# EAGLE schematic M868Hvrs2 (EAGLE 6.6.0)

## Sheet 1 of 3
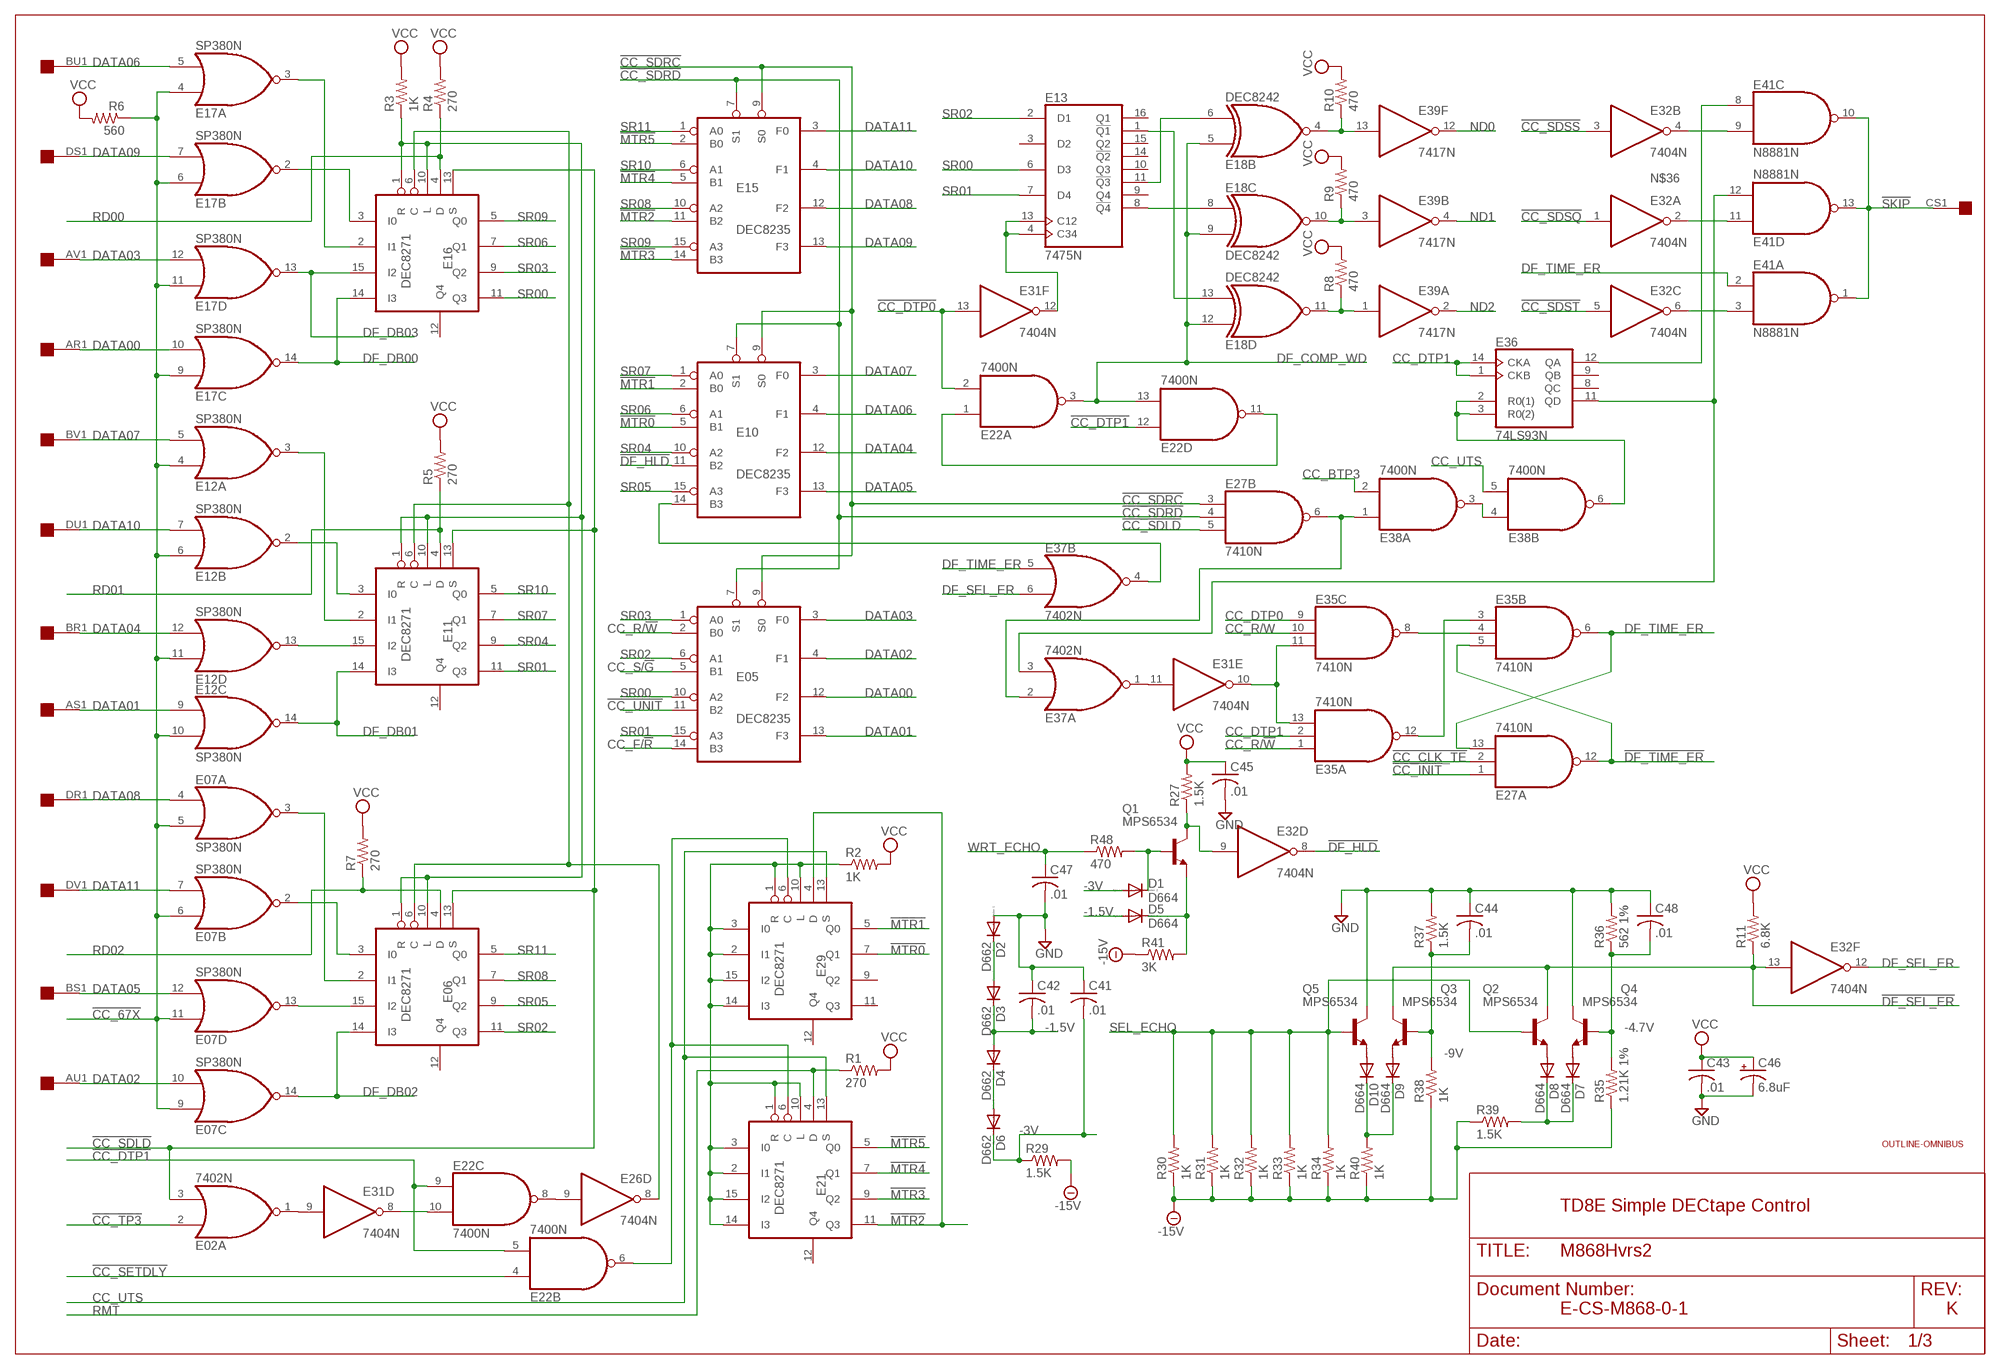
[diagram p0: schematic, sheet 1]

### Parts
C41  .01  C-US050-025X075  [C050-025X075]
C42  .01  C-US050-025X075  [C050-025X075]
C43  .01  C-US050-025X075  [C050-025X075]
C44  .01  C-US050-025X075  [C050-025X075]
C45  .01  C-US050-025X075  [C050-025X075]
C46  6.8uF  CPOL-USE20-8AXIAL  [E12-8]
C47  .01  C-US050-025X075  [C050-025X075]
C48  .01  C-US050-025X075  [C050-025X075]
D1  D664  1N4148DO35-10  [DO35-10]
D2  D662  1N4148DO35-10  [DO35-10]
D3  D662  1N4148DO35-10  [DO35-10]
D4  D662  1N4148DO35-10  [DO35-10]
D5  D664  1N4148DO35-10  [DO35-10]
D6  D662  1N4148DO35-10  [DO35-10]
D7  D664  1N4148DO35-10  [DO35-10]
D8  D664  1N4148DO35-10  [DO35-10]
D9  D664  1N4148DO35-10  [DO35-10]
D10  D664  1N4148DO35-10  [DO35-10]
E02  7402N  [DIL14]
E05  DEC8235  [DIL16]
E06  DEC8271  [DIL16]
E07  SP380N  [DIL14]
E10  DEC8235  [DIL16]
E11  DEC8271  [DIL16]
E12  SP380N  [DIL14]
E13  7475N  [DIL16]
E15  DEC8235  [DIL16]
E16  DEC8271  [DIL16]
E17  SP380N  [DIL14]
E18  DEC8242  74LS266N  [DIL14]
E21  DEC8271  [DIL16]
E22  7400N  [DIL14]
E26  7404N  [DIL14]
E27  7410N  [DIL14]
E29  DEC8271  [DIL16]
E31  7404N  [DIL14]
E32  7404N  [DIL14]
E35  7410N  [DIL14]
E36  74LS93N  [DIL14]
E37  7402N  [DIL14]
E38  7400N  [DIL14]
E39  7417N  [DIL14]
E41  N8881N  [DIL14]
EDGE$  QUAD  [EDGE-CON8]
Q1  MPS6534  2N2219  [TO5]
Q2  MPS6534  2N2219  [TO5]
Q3  MPS6534  2N2219  [TO5]
Q4  MPS6534  2N2219  [TO5]
Q5  MPS6534  2N2219  [TO5]
R1  270  R-US_0207/10  [0207/10]
R2  1K  R-US_0207/10  [0207/10]
R3  1K  R-US_0207/10  [0207/10]
R4  270  R-US_0207/10  [0207/10]
R5  270  R-US_0207/10  [0207/10]
R6  560  R-US_0207/10  [0207/10]
R7  270  R-US_0207/10  [0207/10]
R8  470  R-US_0207/10  [0207/10]
R9  470  R-US_0207/10  [0207/10]
R10  470  R-US_0207/10  [0207/10]
R11  6.8K  R-US_0207/10  [0207/10]
R27  1.5K  R-US_0207/10  [0207/10]
R29  1.5K  R-US_0207/10  [0207/10]
R30  1K  R-US_0207/10  [0207/10]
R31  1K  R-US_0207/10  [0207/10]
R32  1K  R-US_0207/10  [0207/10]
R33  1K  R-US_0207/10  [0207/10]
R34  1K  R-US_0207/10  [0207/10]
R35  1.21K 1%  R-US_0207/15  [0207/15]
R36  562 1%  R-US_0207/15  [0207/15]
R37  1.5K  R-US_0207/10  [0207/10]
R38  1K  R-US_0207/10  [0207/10]
R39  1.5K  R-US_0207/10  [0207/10]
R40  1K  R-US_0207/10  [0207/10]
R41  3K  R-US_0207/10  [0207/10]
R48  470  R-US_0207/10  [0207/10]
U$1  OUTLINE-OMNIBUS  [OMNIBUS]

### Nets
!CC_67X: E07.5(A:I1) E07.6(B:I0) E07.9(C:I0) E07.11(D:I0) E12.4(A:I0) E12.6(B:I0) E12.10(C:I1) E12.11(D:I0) E17.4(A:I0) E17.6(B:I0) E17.9(C:I0) E17.11(D:I0) R6.1 ; also sheet 2
!CC_CLK_TE: E27.2(A:I1) ; also sheet 2
!CC_DTP0: E22.2(A:I1) E31.13(F:I) ; also sheet 2
!CC_DTP1: E22.5(B:I1) E22.9(C:I0) E22.12(D:I0) ; also sheet 2
!CC_INIT: E27.1(A:I0) ; also sheet 2
!CC_SDLD: E02.3(A:I1) E06.13(S) E11.13(S) E16.13(S) E27.5(B:I2) ; also sheet 2
!CC_SDRC: E05.9(S0) E10.9(S0) E15.9(S0) E27.3(B:I0) ; also sheet 2
!CC_SDRD: E05.7(S1) E10.7(S1) E15.7(S1) E27.4(B:I1) ; also sheet 2
!CC_SDSQ: E32.1(A:I) ; also sheet 2
!CC_SDSS: E32.3(B:I) ; also sheet 2
!CC_SDST: E32.5(C:I) ; also sheet 2
!CC_SETDLY: E22.4(B:I0) ; also sheet 2
!CC_TP3: E02.2(A:I0) ; also sheet 2
!CC_UNIT: E05.11(B2) ; also sheet 2
!DF_HLD: E10.11(B2) E32.8(D:O) ; also sheet 2
!DF_SEL_ER: E32.13(F:I) Q2.3(C) Q3.3(C) R11.1 ; also sheet 2
!DF_TIME_ER: E27.12(A:O) E35.5(B:I2) ; also sheet 2
!MTR0: E10.5(B1) E29.7(Q1)
!MTR1: E10.2(B0) E29.5(Q0)
!MTR2: E15.11(B2) E21.11(Q3) E29.4(D)
!MTR3: E15.14(B3) E21.9(Q2)
!MTR4: E15.5(B1) E21.7(Q1)
!MTR5: E15.2(B0) E21.5(Q0)
!SKIP: E41.1(A:O) E41.10(C:O) E41.13(D:O) EDGE$.CS1
-1.5V: C42.2 D3.C D4.A D5.A
-3V: C41.2 D1.A D6.C R29.1
-4.7V: C48.2 Q4.2(B) R35.2 R36.1
-9V: C44.2 Q3.2(B) R37.1 R38.2
-15V [supply]: R29.2 R30.1 R31.1 R32.1 R33.1 R34.1 R35.1 R38.1 R39.1 R40.1 R41.1 ; also sheet 3
CC_BTP3: E38.2(A:I1) ; also sheet 2
CC_DTP0: E35.9(C:I0) ; also sheet 2
CC_DTP1: E35.2(A:I1) E36.1(CKB) E36.14(CKA) ; also sheet 2
CC_F/!R: E05.14(B3) ; also sheet 2
CC_R/!W: E05.2(B0) E35.1(A:I0) ; also sheet 2
CC_R/W: E35.10(C:I1) ; also sheet 2
CC_S/!G: E05.5(B1) ; also sheet 2
CC_UTS: E21.13(S) E29.13(S) E38.5(B:I1) ; also sheet 2
DATA00: E05.12(F2) E17.10(C:I1) EDGE$.AR1
DATA01: E05.13(F3) E12.9(C:I0) EDGE$.AS1
DATA02: E05.4(F1) E07.10(C:I1) EDGE$.AU1
DATA03: E05.3(F0) E17.12(D:I1) EDGE$.AV1
DATA04: E10.12(F2) E12.12(D:I1) EDGE$.BR1
DATA05: E07.12(D:I1) E10.13(F3) EDGE$.BS1
DATA06: E10.4(F1) E17.5(A:I1) EDGE$.BU1
DATA07: E10.3(F0) E12.5(A:I1) EDGE$.BV1
DATA08: E07.4(A:I0) E15.12(F2) EDGE$.DR1
DATA09: E15.13(F3) E17.7(B:I1) EDGE$.DS1
DATA10: E12.7(B:I1) E15.4(F1) EDGE$.DU1
DATA11: E07.7(B:I1) E15.3(F0) EDGE$.DV1
DF_COMP_WD: E18.5(B:I0) E18.9(C:I1) E18.12(D:I0) E22.3(A:O) E22.13(D:I1)
DF_DB00: E16.14(I3) E17.14(C:O) ; also sheet 2
DF_DB01: E11.14(I3) E12.14(C:O) ; also sheet 2
DF_DB02: E06.14(I3) E07.14(C:O) ; also sheet 2
DF_DB03: E16.15(I2) E17.13(D:O) ; also sheet 2
DF_SEL_ER: E32.12(F:O) E37.6(B:I1)
DF_TIME_ER: E27.13(A:I2) E35.6(B:O) E37.5(B:I0) E41.2(A:I0)
GND [supply]: C41.1 C42.1 C43.2 C44.1 C45.2 C46.- C47.2 C48.1 D2.A Q4.3(C) Q5.3(C) R36.2 R37.2 ; also sheet 2,3
N$1: E06.1(R) E06.10(L) E11.1(R) E11.10(L) E16.1(R) E16.10(L) R3.1
N$2: E02.1(A:O) E31.9(D:I)
N$3: E16.2(I1) E17.3(A:O)
N$4: E16.3(I0) E17.2(B:O)
N$5: E21.1(R) E21.2(I1) E21.3(I0) E21.10(L) E21.14(I3) E21.15(I2) E29.1(R) E29.2(I1) E29.3(I0) E29.10(L) E29.14(I3) E29.15(I2) R2.1
N$7: E06.6(C) E11.6(C) E16.6(C) E26.8(D:O)
N$8: E11.2(I1) E12.3(A:O)
N$9: E11.3(I0) E12.2(B:O)
N$10: E13.11(!Q3) E18.6(B:I1)
N$11: E11.15(I2) E12.13(D:O)
N$13: E06.2(I1) E07.3(A:O)
N$14: E06.3(I0) E07.2(B:O)
N$16: E06.15(I2) E07.13(D:O)
N$22: E27.6(B:O) E37.2(A:I0) E38.1(A:I0)
N$25: E36.12(QA) E41.8(C:I0)
N$29: E22.8(C:O) E26.9(D:I)
N$30: E22.10(C:I1) E31.8(D:O)
N$31: E21.6(C) E22.6(B:O) E29.6(C)
N$32: E13.1(!Q1) E18.13(D:I1)
N$33: E18.11(D:O) E39.1(A:I) R8.1
N$34: E13.8(!Q4) E18.8(C:I0)
N$35: E13.4(C34) E13.13(C12) E31.12(F:O)
N$36: E36.11(QD) E37.3(A:I1) E41.12(D:I1)
N$37: E22.1(A:I0) E22.11(D:O)
N$38: E18.10(C:O) E39.3(B:I) R9.1
N$39: E18.4(B:O) E39.13(F:I) R10.1
N$41: E10.14(B3) E37.4(B:O)
N$42: E36.2(R0(1)) E36.3(R0(2)) E38.6(B:O)
N$43: E38.3(A:O) E38.4(B:I0)
N$44: E32.6(C:O) E41.3(A:I1)
N$45: E32.2(A:O) E41.11(D:I0)
N$46: E32.4(B:O) E41.9(C:I1)
N$47: E31.11(E:I) E37.1(A:O)
N$48: E31.10(E:O) E35.11(C:I2) E35.13(A:I2)
N$49: E35.3(B:I0) E35.12(A:O)
N$50: E35.4(B:I1) E35.8(C:O)
N$51: D1.C Q1.2(B) R48.2
N$52: D5.C Q1.1(E) R41.2
N$53: E32.9(D:I) Q1.3(C) R27.1
N$54: D2.C D3.A
N$55: D9.C D10.C R40.2
N$56: D4.C D6.A
N$57: D10.A Q5.1(E)
N$58: D9.A Q3.1(E)
N$59: D8.A Q2.1(E)
N$60: D7.A Q4.1(E)
N$63: D7.C D8.C R39.2
ND0: E39.12(F:O) ; also sheet 3
ND1: E39.4(B:O) ; also sheet 3
ND2: E39.2(A:O) ; also sheet 3
RD00: E16.4(D) R4.1 ; also sheet 3
RD01: E11.4(D) R5.1 ; also sheet 3
RD02: E06.4(D) R7.1 ; also sheet 3
RMT: E21.4(D) R1.1 ; also sheet 3
SEL_ECHO: Q2.2(B) Q5.2(B) R30.2 R31.2 R32.2 R33.2 R34.2 ; also sheet 3
SR00: E05.10(A2) E13.6(D3) E16.11(Q3)
SR01: E05.15(A3) E11.11(Q3) E13.7(D4)
SR02: E05.6(A1) E06.11(Q3) E13.2(D1)
SR03: E05.1(A0) E16.9(Q2)
SR04: E10.10(A2) E11.9(Q2)
SR05: E06.9(Q2) E10.15(A3)
SR06: E10.6(A1) E16.7(Q1)
SR07: E10.1(A0) E11.7(Q1)
SR08: E06.7(Q1) E15.10(A2)
SR09: E15.15(A3) E16.5(Q0)
SR10: E11.5(Q0) E15.6(A1)
SR11: E06.5(Q0) E15.1(A0)
VCC [supply]: C43.1 C45.1 C46.+ R1.2 R2.2 R3.2 R4.2 R5.2 R6.2 R7.2 R8.2 R9.2 R10.2 R11.2 R27.2 ; also sheet 2,3
WRT_ECHO: C47.1 R48.1 ; also sheet 3
Unconnected: E06.12(Q4) E11.12(Q4) E13.3(D2) E13.9(Q4) E13.10(Q3) E13.14(!Q2) E13.15(Q2) E13.16(Q1) E16.12(Q4) E21.12(Q4) E29.9(Q2) E29.11(Q3) E29.12(Q4) E36.8(QC) E36.9(QB) E41.4(B:O) E41.5(B:I0) E41.6(B:I1) EDGE$.AA1 EDGE$.AB1 EDGE$.AB2 EDGE$.AC1 EDGE$.AD1 EDGE$.AD2 EDGE$.AE1 EDGE$.AE2 EDGE$.AH1 EDGE$.AH2 EDGE$.AJ1 EDGE$.AJ2 EDGE$.AK1 EDGE$.AK2 EDGE$.AL1 EDGE$.AL2 EDGE$.AM1 EDGE$.AM2 EDGE$.AP2 EDGE$.AR2 EDGE$.AS2 EDGE$.AU2 EDGE$.AV2 EDGE$.BA1 EDGE$.BB1 EDGE$.BB2 EDGE$.BD1 EDGE$.BD2 EDGE$.BE1 EDGE$.BE2 EDGE$.BH1 EDGE$.BH2 EDGE$.BJ1 EDGE$.BJ2 EDGE$.BK2 EDGE$.BL2 EDGE$.BM2 EDGE$.BN1 EDGE$.BP2 EDGE$.BR2 EDGE$.BS2 EDGE$.CA1 EDGE$.CB1 EDGE$.CB2 EDGE$.CD2 EDGE$.CE2 EDGE$.CJ1 EDGE$.CK1 EDGE$.CK2 EDGE$.CL2 EDGE$.CM1 EDGE$.CM2 EDGE$.CP1 EDGE$.CP2 EDGE$.CR2 EDGE$.CS2 EDGE$.CU1 EDGE$.CU2 EDGE$.CV1 EDGE$.CV2 EDGE$.DA1 EDGE$.DA2 EDGE$.DB1 EDGE$.DD1 EDGE$.DD2 EDGE$.DE1 EDGE$.DE2 EDGE$.DH1 EDGE$.DH2 EDGE$.DJ1 EDGE$.DJ2 EDGE$.DK2 EDGE$.DL2 EDGE$.DM2 EDGE$.DP2 EDGE$.DR2 EDGE$.DS2 EDGE$.DU2 EDGE$.DV2

### Notes on the sheet
- TD8E Simple DECtape Control
- E-CS-M868-0-1 | K

## Sheet 2 of 3
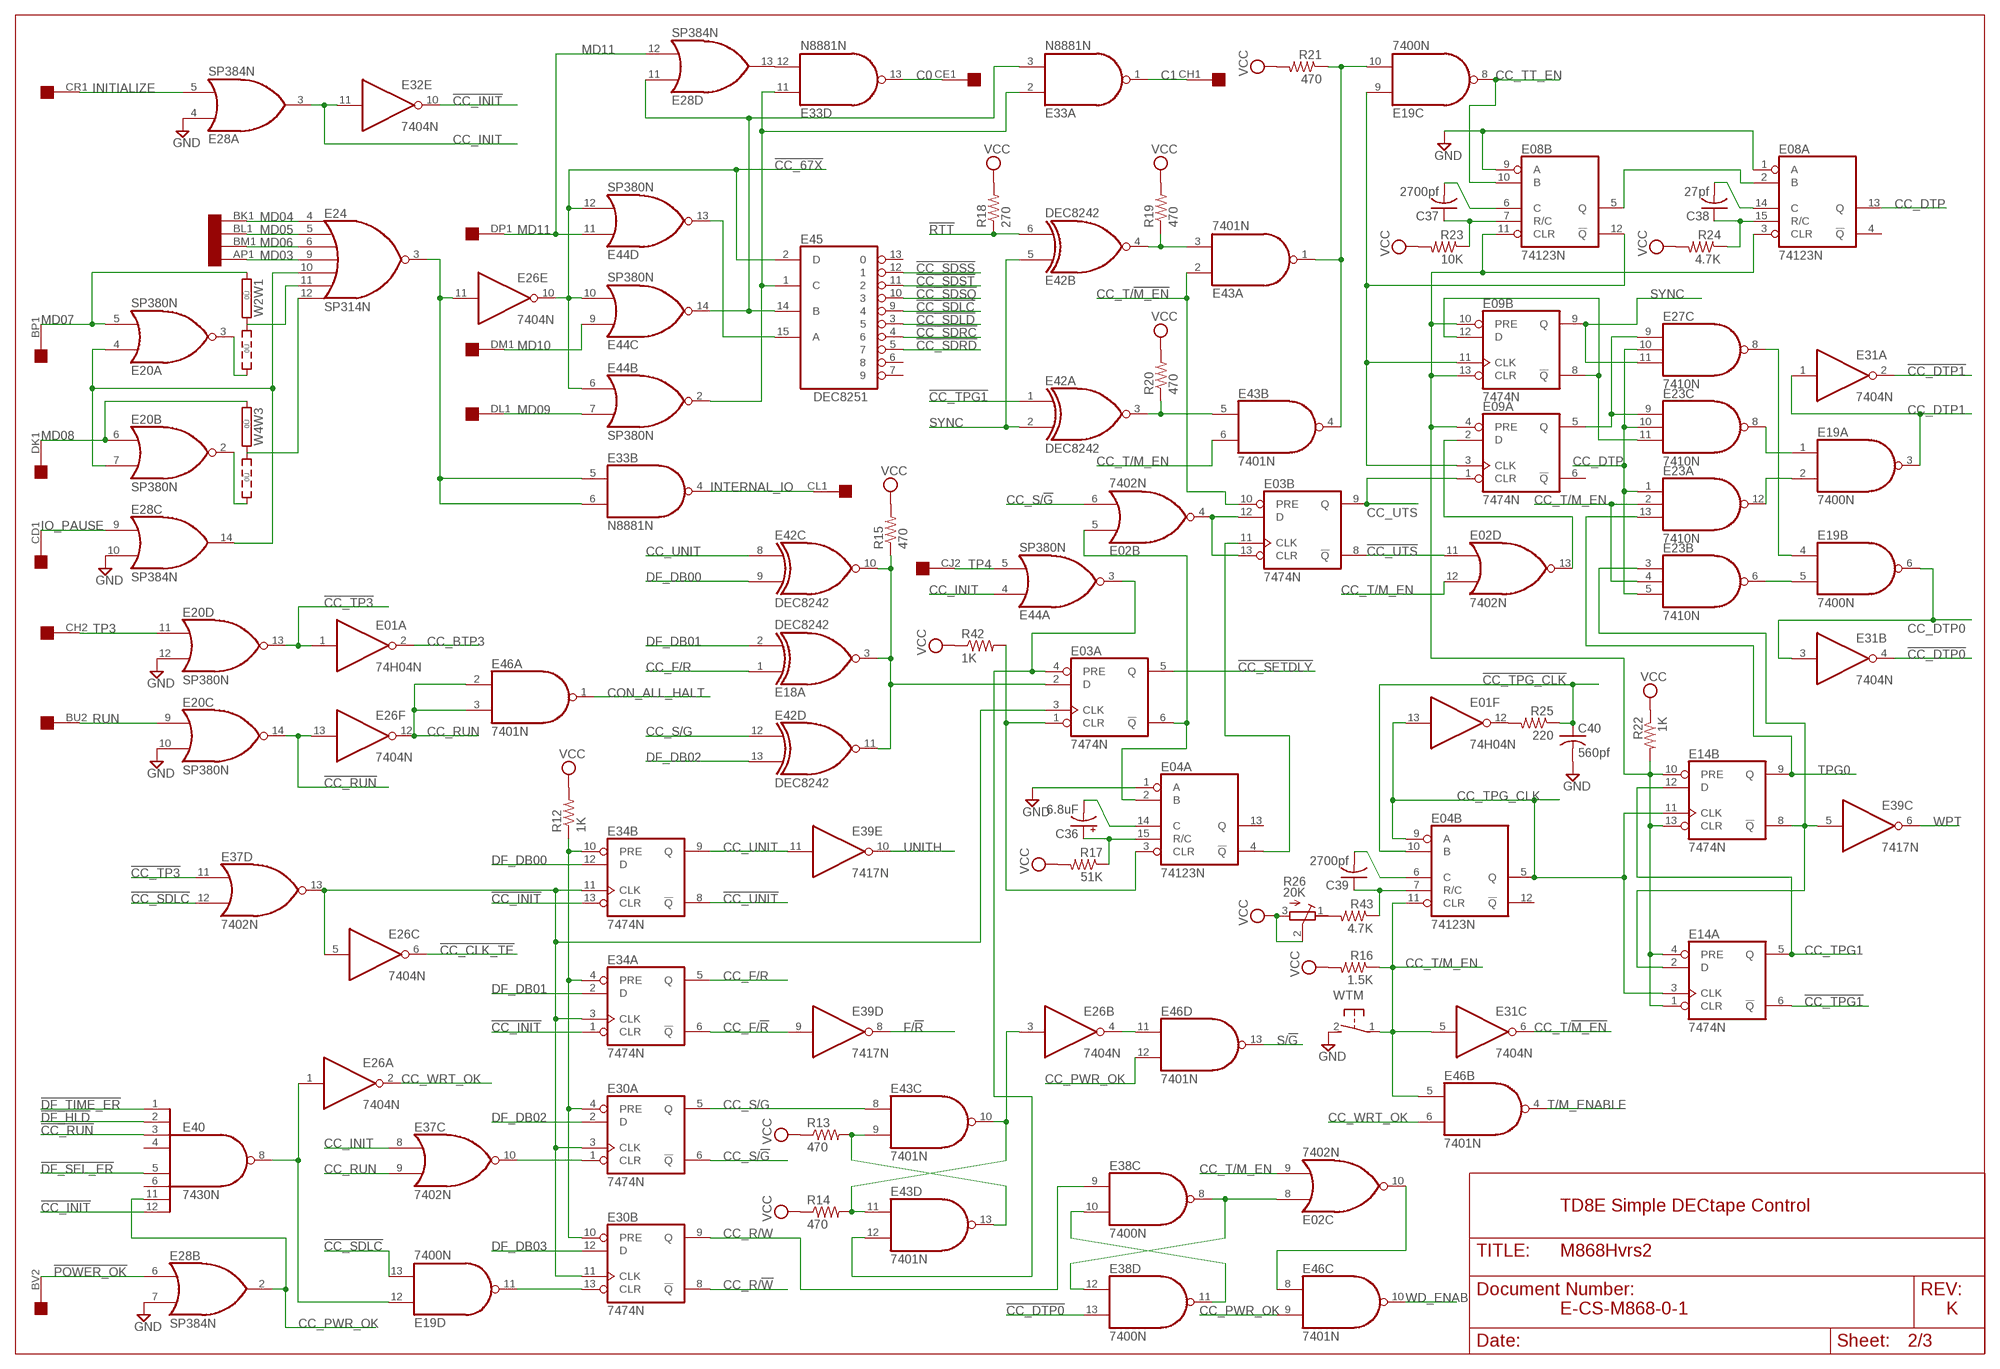
[diagram p1: schematic, sheet 2]

### Parts
C36  6.8uF  CPOL-USE20-8AXIAL  [E12-8]
C37  2700pf  C-US102-043X133  [C102-043X133]
C38  27pf  C-US050-025X075  [C050-025X075]
C39  2700pf  C-US102-043X133  [C102-043X133]
C40  560pf  C-US075-032X103  [C075-032X103]
E01  74H04N  74S04N  [DIL14]
E03  7474N  74S74N  [DIL14]
E04  74123N  [DIL16]
E08  74123N  [DIL16]
E09  7474N  74S74N  [DIL14]
E14  7474N  74S74N  [DIL14]
E19  7400N  [DIL14]
E20  SP380N  [DIL14]
E23  7410N  [DIL14]
E24  SP314N  [DIL14]
E28  SP384N  [DIL14]
E30  7474N  74S74N  [DIL14]
E33  N8881N  [DIL14]
E34  7474N  74S74N  [DIL14]
E40  7430N  [DIL14]
E42  DEC8242  74LS266N  [DIL14]
E43  7401N  74LS01N  [DIL14]
E44  SP380N  [DIL14]
E45  DEC8251  [DIL16]
E46  7401N  74LS01N  [DIL14]
R12  1K  R-US_0207/10  [0207/10]
R13  470  R-US_0207/10  [0207/10]
R14  470  R-US_0207/10  [0207/10]
R15  470  R-US_0207/10  [0207/10]
R16  1.5K  R-US_0207/10  [0207/10]
R17  51K  R-US_0207/10  [0207/10]
R18  270  R-US_0207/10  [0207/10]
R19  470  R-US_0207/10  [0207/10]
R20  470  R-US_0207/10  [0207/10]
R21  470  R-US_0207/10  [0207/10]
R22  1K  R-US_0207/10  [0207/10]
R23  10K  R-US_0207/10  [0207/10]
R24  4.7K  R-US_0207/10  [0207/10]
R25  220  R-US_0207/10  [0207/10]
R26  20K  275P  [3006Y]
R42  1K  R-US_0207/10  [0207/10]
R43  4.7K  R-US_0207/10  [0207/10]
W2W1  0R2  [0R2/10]
W4W3  0R2  [0R2/10]
WTM  31-XX  [B3F-31XX]

### Nets
!CC_67X: E26.10(E:O) E44.6(B:I0) E44.10(C:I1) E44.12(D:I1) E45.2(D) ; also sheet 1
!CC_CLK_TE: E26.6(C:O) ; also sheet 1
!CC_DTP0: E31.4(B:O) E38.13(D:I1) ; also sheet 1
!CC_DTP1: E31.2(A:O) ; also sheet 1
!CC_INIT: E32.10(E:O) E34.1(A:CLR) E34.13(B:CLR) E40.12(I7) ; also sheet 1
!CC_RUN: E20.14(C:O) E26.13(F:I) E40.3(I2)
!CC_SDLC: E19.13(D:I1) E37.12(D:I1) E45.9
!CC_SDLD: E45.3 ; also sheet 1
!CC_SDRC: E45.4 ; also sheet 1
!CC_SDRD: E45.5 ; also sheet 1
!CC_SDSQ: E45.10 ; also sheet 1
!CC_SDSS: E45.12 ; also sheet 1
!CC_SDST: E45.11 ; also sheet 1
!CC_SETDLY: E03.5(A:Q) ; also sheet 1
!CC_TP3: E01.1(A:I) E20.13(D:O) E37.11(D:I0) ; also sheet 1
!CC_TPG1: E14.6(A:!Q) E42.1(A:I0)
!CC_TPG_CLK: C40.1 E04.10(B:B) R25.1
!CC_UNIT: E34.8(B:!Q) ; also sheet 1
!CC_UTS: E02.11(D:I0) E03.8(B:!Q)
!DF_HLD: E40.2(I1) ; also sheet 1
!DF_SEL_ER: E40.5(I4) ; also sheet 1
!DF_TIME_ER: E40.1(I0) ; also sheet 1
!IO_PAUSE: E20.4(A:I0) E20.7(B:I1) E24.10(I4) E28.14(C:O)
!POWER_OK: E28.6(B:I0) EDGE$.BV2
!RTT: E42.6(B:I1) R18.1 ; also sheet 3
C0: E33.13(D:O) EDGE$.CE1
C1: E33.1(A:O) EDGE$.CH1
CC_67X: E24.3(O) E26.11(E:I) E33.5(B:I0) E33.6(B:I1)
CC_BTP3: E01.2(A:O) ; also sheet 1
CC_DTP: E08.13(A:Q) E23.1(A:I0) E23.5(B:I2) E23.10(C:I1) E27.10(C:I1)
CC_DTP0: E19.6(B:O) E31.3(B:I) ; also sheet 1
CC_DTP1: E19.3(A:O) E31.1(A:I) ; also sheet 1
CC_F/!R: E34.6(A:!Q) E39.9(D:I) ; also sheet 1
CC_F/R: E18.1(A:I0) E34.5(A:Q)
CC_INIT: E28.3(A:O) E32.11(E:I) E37.8(C:I0) E44.4(A:I0)
CC_PWR_OK: E28.2(B:O) E40.11(I6) E46.9(C:I1) E46.12(D:I1)
CC_R/!W: E30.8(B:!Q) ; also sheet 1
CC_R/W: E30.9(B:Q) E38.9(C:I0) ; also sheet 1
CC_RUN: E26.12(F:O) E37.9(C:I1) E46.2(A:I0) E46.3(A:I1)
CC_S/!G: E02.6(B:I1) E30.6(A:!Q) ; also sheet 1
CC_S/G: E30.5(A:Q) E42.12(D:I0) E43.8(C:I0)
CC_SETDLY: E02.5(B:I0) E03.6(A:!Q) E04.2(A:B)
CC_T/!M_EN: E03.10(B:PRE) E31.6(C:O) E43.2(A:I0)
CC_T/M_EN: E02.9(C:I1) E02.12(D:I1) E04.11(B:CLR) E23.2(A:I1) E23.4(B:I1) E31.5(C:I) E43.6(B:I1) E46.5(B:I0) R16.1 WTM.1(P)
CC_TPG1: E14.5(A:Q) E14.12(B:D)
CC_TPG_CLK: E01.13(F:I) E04.5(B:Q) E04.9(B:A) E14.3(A:CLK) E14.11(B:CLK)
CC_TT_EN: E08.10(B:B) E19.8(C:O)
CC_UNIT: E34.9(B:Q) E39.11(E:I) E42.8(C:I0)
CC_UTS: E03.9(B:Q) E09.1(A:CLR) ; also sheet 1
CC_WRT_OK: E26.2(A:O) E46.6(B:I1)
CON_ALL_HALT: E46.1(A:O) ; also sheet 3
DF_DB00: E34.12(B:D) E42.9(C:I1) ; also sheet 1
DF_DB01: E18.2(A:I1) E34.2(A:D) ; also sheet 1
DF_DB02: E30.2(A:D) E42.13(D:I1) ; also sheet 1
DF_DB03: E30.12(B:D) ; also sheet 1
F/!R: E39.8(D:O) ; also sheet 3
GND [supply]: C40.2 E04.1(A:A) E08.1(A:A) E08.9(B:A) E20.10(C:I1) E20.12(D:I1) E28.4(A:I0) E28.7(B:I1) E28.10(C:I1) WTM.2(S) ; also sheet 1,3
INITIALIZE: E28.5(A:I1) EDGE$.CR1
INTERNAL_IO: E33.4(B:O) EDGE$.CL1
IO_PAUSE: E28.9(C:I0) EDGE$.CD1
MD03: E24.9(I3) EDGE$.AP1
MD04: E24.4(I0) EDGE$.BK1
MD05: E24.5(I1) EDGE$.BL1
MD06: E24.6(I2) EDGE$.BM1
MD07: E20.5(A:I1) EDGE$.BP1 W2W1.1
MD08: E20.6(B:I0) EDGE$.DK1 W4W3.1
MD09: E44.7(B:I1) EDGE$.DL1
MD10: E44.9(C:I0) EDGE$.DM1
MD11: E28.12(D:I1) E44.11(D:I0) EDGE$.DP1
N$6: E43.9(C:I1) E43.13(D:O) R13.2
N$12: E28.13(D:O) E33.12(D:I1)
N$17: E08.3(A:CLR) E08.11(B:CLR) E09.4(A:PRE) E09.10(B:PRE) E09.13(B:CLR) E14.1(A:CLR) E14.4(A:PRE) E14.10(B:PRE) E14.13(B:CLR) R22.2
N$18: E30.1(A:CLR) E37.10(C:O)
N$20: E26.3(B:I) E43.10(C:O) E43.11(D:I0) R14.2
N$61: E24.11(I5) W2W1.2
N$62: E24.12(I6) W4W3.2
N$65: E20.3(A:O) W2W1.3
N$66: E19.12(D:I0) E26.1(A:I) E40.8(O)
N$67: E20.2(B:O) W4W3.3
N$68: E19.11(D:O) E30.13(B:CLR)
N$69: E33.2(A:I0) E33.11(D:I0) E44.2(B:O) E45.1(C)
N$70: E28.11(D:I0) E33.3(A:I1) E44.14(C:O) E45.14(B)
N$71: E44.13(D:O) E45.15(A)
N$72: E42.4(B:O) E43.3(A:I1) R19.1
N$73: E19.10(C:I1) E43.1(A:O) E43.4(B:O) R21.1
N$74: E42.3(A:O) E43.5(B:I0) R20.1
N$77: E08.2(A:B) E08.5(B:Q)
N$78: C37.1 E08.7(B:R/C) R23.1
N$79: C38.1 E08.15(A:R/C) R24.1
N$80: E08.12(B:!Q) E09.3(A:CLK) E09.11(B:CLK) E19.9(C:I0)
N$81: C38.2 E08.14(A:C)
N$82: C37.2 E08.6(B:C)
N$83: E03.3(A:CLK) E26.5(C:I) E30.3(A:CLK) E30.11(B:CLK) E34.3(A:CLK) E34.11(B:CLK) E37.13(D:O)
N$84: E30.4(A:PRE) E30.10(B:PRE) E34.4(A:PRE) E34.10(B:PRE) R12.1
N$85: E38.10(C:I1) E38.11(D:O)
N$86: E02.8(C:I0) E38.8(C:O) E38.12(D:I0)
N$87: E03.4(A:PRE) E43.12(D:I1) E44.3(A:O)
N$88: E26.4(B:O) E46.11(D:I0)
N$89: E02.10(C:O) E46.8(C:I0)
N$90: E03.2(A:D) E18.3(A:O) E42.10(C:O) E42.11(D:O) R15.1
N$92: E03.1(A:CLR) E04.3(A:CLR) R42.2
N$94: C36.+ E04.15(A:R/C) R17.1
N$95: C36.- E04.14(A:C)
N$96: E03.11(B:CLK) E04.4(A:!Q)
N$97: E02.4(B:O) E03.12(B:D) E03.13(B:CLR)
N$98: E02.13(D:O) E09.2(A:D)
N$100: E19.5(B:I1) E23.6(B:O)
N$101: E09.5(A:Q) E23.9(C:I0) E27.9(C:I0)
N$102: E09.8(B:!Q) E09.12(B:D) E23.11(C:I2)
N$104: E19.2(A:I1) E23.12(A:O)
N$106: E19.1(A:I0) E23.8(C:O)
N$107: E14.2(A:D) E14.8(B:!Q) E23.3(B:I0) E39.5(C:I)
N$108: C39.1 E04.7(B:R/C) R43.1
N$109: E19.4(B:I0) E27.8(C:O)
N$110: C39.2 E04.6(B:C)
N$111: R26.1(A) R43.2
N$112: E01.12(F:O) R25.2
RUN: E20.9(C:I0) EDGE$.BU2
S/!G: E46.13(D:O) ; also sheet 3
SYNC: E09.9(B:Q) E27.11(C:I2) E42.2(A:I1) E42.5(B:I0)
T/M_ENABLE: E46.4(B:O) ; also sheet 3
TP3: E20.11(D:I0) EDGE$.CH2
TP4: E44.5(A:I1) EDGE$.CJ2
TPG0: E14.9(B:Q) E23.13(A:I2)
UNITH: E39.10(E:O) ; also sheet 3
VCC [supply]: R12.2 R13.1 R14.1 R15.2 R16.2 R17.2 R18.2 R19.2 R20.2 R21.2 R22.1 R23.2 R24.2 R26.2(S) R26.3(E) R42.1 ; also sheet 1,3
WD_ENAB: E46.10(C:O) ; also sheet 3
WPT: E39.6(C:O) ; also sheet 3
Unconnected: E01.3(B:I) E01.4(B:O) E01.5(C:I) E01.6(C:O) E01.8(D:O) E01.9(D:I) E01.10(E:O) E01.11(E:I) E04.12(B:!Q) E04.13(A:Q) E08.4(A:!Q) E09.6(A:!Q) E33.8(C:I0) E33.9(C:I1) E33.10(C:O) E40.4(I3) E40.6(I5) E45.6 E45.7 E45.13

### Notes on the sheet
- TD8E Simple DECtape Control
- E-CS-M868-0-1 | K

## Sheet 3 of 3
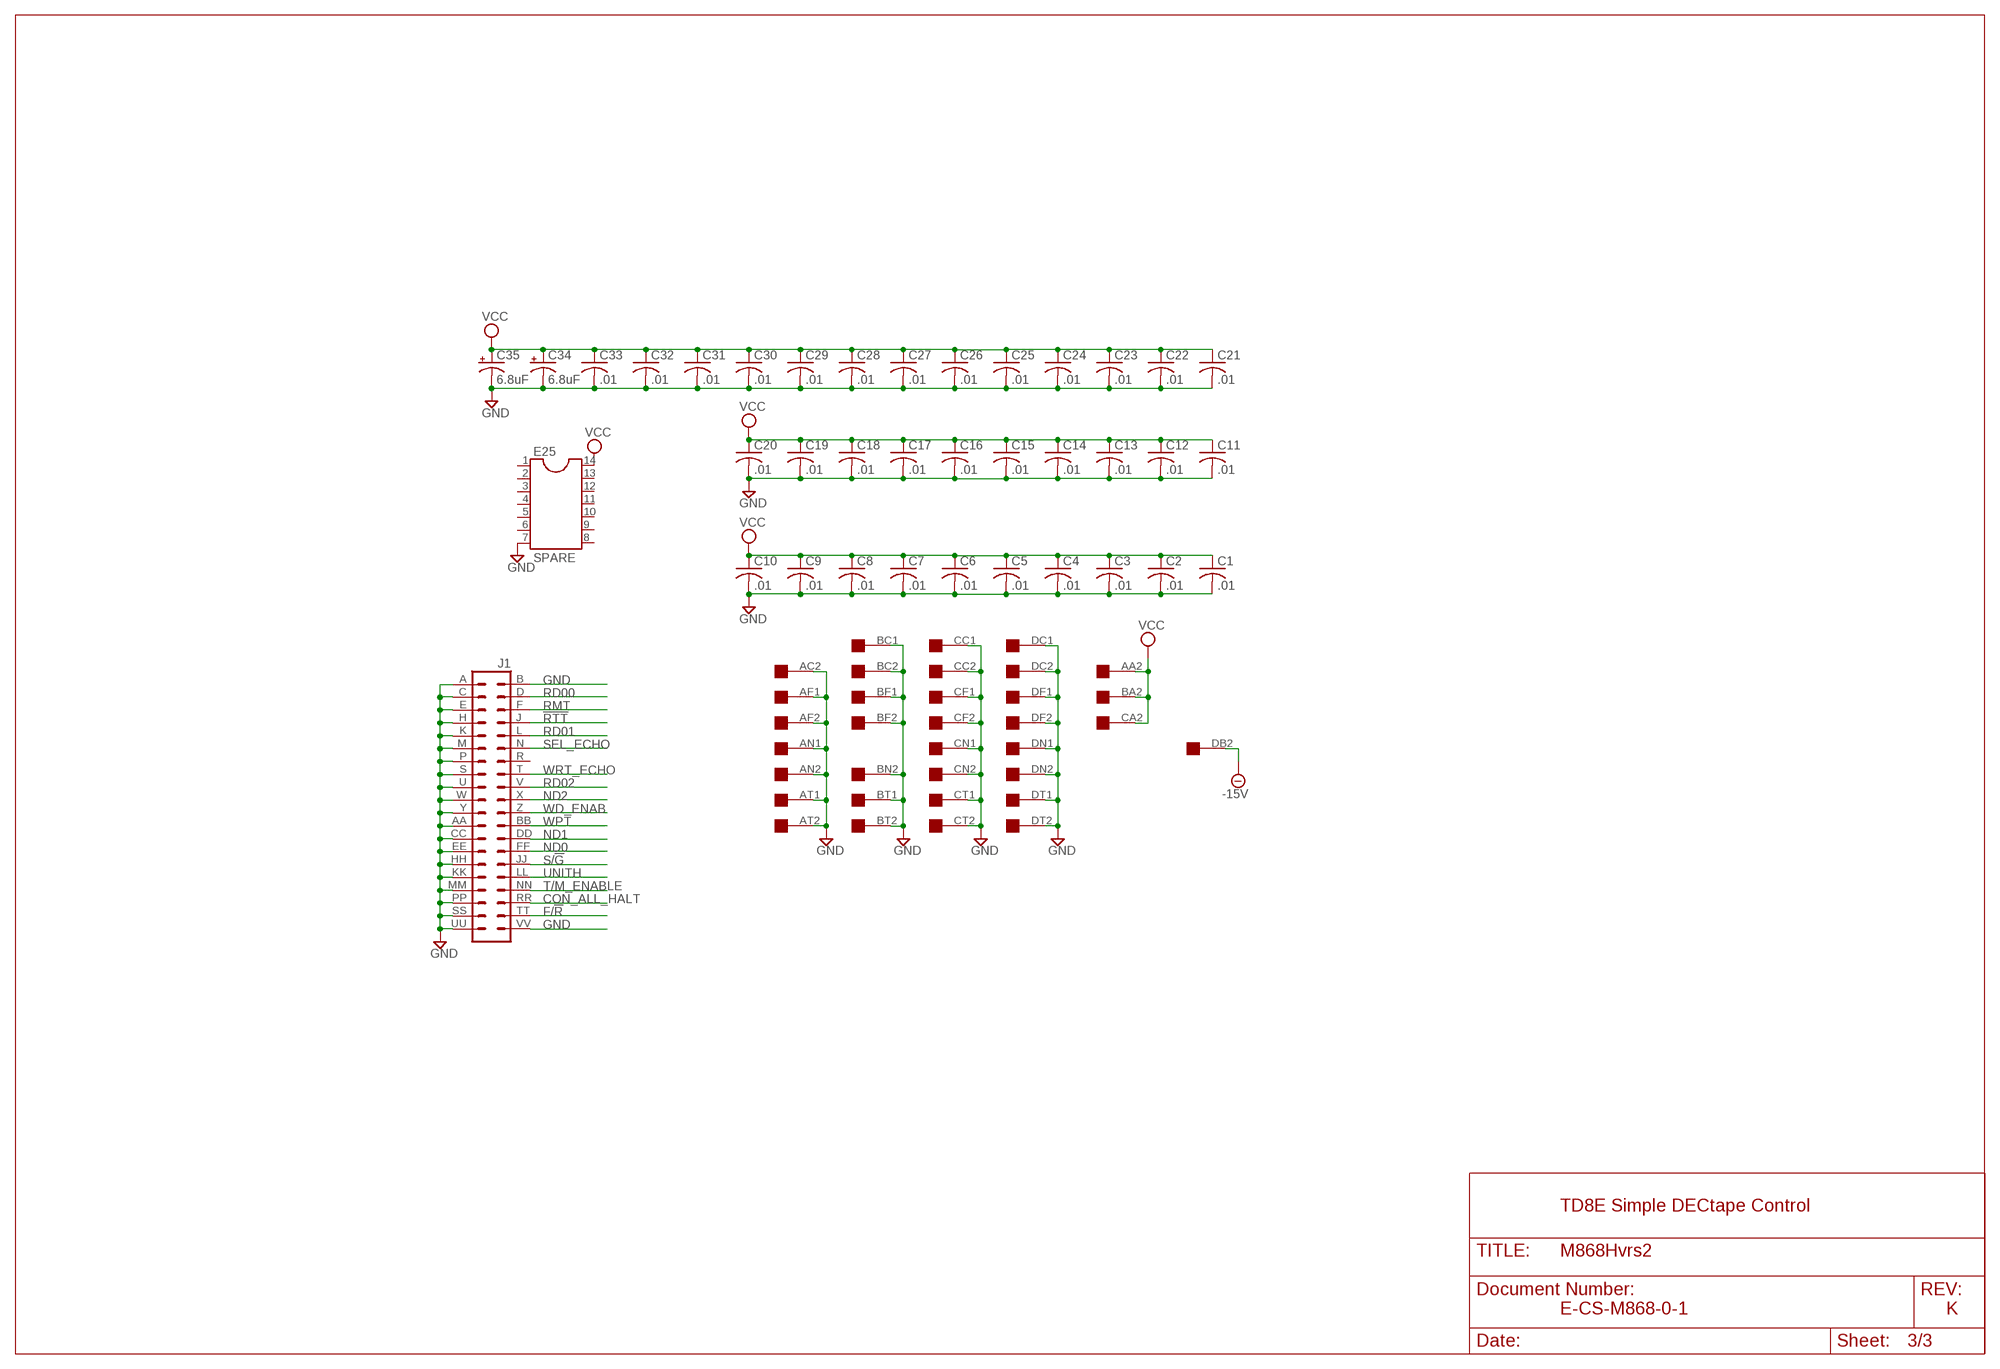
[diagram p2: schematic, sheet 3]

### Parts
C1  .01  C-US050-025X075  [C050-025X075]
C2  .01  C-US050-025X075  [C050-025X075]
C3  .01  C-US050-025X075  [C050-025X075]
C4  .01  C-US050-025X075  [C050-025X075]
C5  .01  C-US050-025X075  [C050-025X075]
C6  .01  C-US050-025X075  [C050-025X075]
C7  .01  C-US050-025X075  [C050-025X075]
C8  .01  C-US050-025X075  [C050-025X075]
C9  .01  C-US050-025X075  [C050-025X075]
C10  .01  C-US050-025X075  [C050-025X075]
C11  .01  C-US050-025X075  [C050-025X075]
C12  .01  C-US050-025X075  [C050-025X075]
C13  .01  C-US050-025X075  [C050-025X075]
C14  .01  C-US050-025X075  [C050-025X075]
C15  .01  C-US050-025X075  [C050-025X075]
C16  .01  C-US050-025X075  [C050-025X075]
C17  .01  C-US050-025X075  [C050-025X075]
C18  .01  C-US050-025X075  [C050-025X075]
C19  .01  C-US050-025X075  [C050-025X075]
C20  .01  C-US050-025X075  [C050-025X075]
C21  .01  C-US050-025X075  [C050-025X075]
C22  .01  C-US050-025X075  [C050-025X075]
C23  .01  C-US050-025X075  [C050-025X075]
C24  .01  C-US050-025X075  [C050-025X075]
C25  .01  C-US050-025X075  [C050-025X075]
C26  .01  C-US050-025X075  [C050-025X075]
C27  .01  C-US050-025X075  [C050-025X075]
C28  .01  C-US050-025X075  [C050-025X075]
C29  .01  C-US050-025X075  [C050-025X075]
C30  .01  C-US050-025X075  [C050-025X075]
C31  .01  C-US050-025X075  [C050-025X075]
C32  .01  C-US050-025X075  [C050-025X075]
C33  .01  C-US050-025X075  [C050-025X075]
C34  6.8uF  CPOL-USE20-8AXIAL  [E12-8]
C35  6.8uF  CPOL-USE20-8AXIAL  [E12-8]
E25  SPARE  DIL14  [DIL14]
J1  DEC40PINH  [DEC40PINH]

### Nets
!RTT: J1.J ; also sheet 2
-15V [supply]: EDGE$.DB2 ; also sheet 1
CON_ALL_HALT: J1.RR ; also sheet 2
F/!R: J1.TT ; also sheet 2
GND [supply]: C1.2 C2.2 C3.2 C4.2 C5.2 C6.2 C7.2 C8.2 C9.2 C10.2 C11.2 C12.2 C13.2 C14.2 C15.2 C16.2 C17.2 C18.2 C19.2 C20.2 C21.2 C22.2 C23.2 C24.2 C25.2 C26.2 C27.2 C28.2 C29.2 C30.2 C31.2 C32.2 C33.2 C34.- C35.- E25.7 EDGE$.AC2 EDGE$.AF1 EDGE$.AF2 EDGE$.AN1 EDGE$.AN2 EDGE$.AT1 EDGE$.AT2 EDGE$.BC1 EDGE$.BC2 EDGE$.BF1 EDGE$.BF2 EDGE$.BN2 EDGE$.BT1 EDGE$.BT2 EDGE$.CC1 EDGE$.CC2 EDGE$.CF1 EDGE$.CF2 EDGE$.CN1 EDGE$.CN2 EDGE$.CT1 EDGE$.CT2 EDGE$.DC1 EDGE$.DC2 EDGE$.DF1 EDGE$.DF2 EDGE$.DN1 EDGE$.DN2 EDGE$.DT1 EDGE$.DT2 J1.A J1.AA J1.B J1.C J1.CC J1.E J1.EE J1.H J1.HH J1.K J1.KK J1.M J1.MM J1.P J1.PP J1.S J1.SS J1.U J1.UU J1.VV J1.W J1.Y ; also sheet 1,2
ND0: J1.FF ; also sheet 1
ND1: J1.DD ; also sheet 1
ND2: J1.X ; also sheet 1
RD00: J1.D ; also sheet 1
RD01: J1.L ; also sheet 1
RD02: J1.V ; also sheet 1
RMT: J1.F ; also sheet 1
S/!G: J1.JJ ; also sheet 2
SEL_ECHO: J1.N ; also sheet 1
T/M_ENABLE: J1.NN ; also sheet 2
UNITH: J1.LL ; also sheet 2
VCC [supply]: C1.1 C2.1 C3.1 C4.1 C5.1 C6.1 C7.1 C8.1 C9.1 C10.1 C11.1 C12.1 C13.1 C14.1 C15.1 C16.1 C17.1 C18.1 C19.1 C20.1 C21.1 C22.1 C23.1 C24.1 C25.1 C26.1 C27.1 C28.1 C29.1 C30.1 C31.1 C32.1 C33.1 C34.+ C35.+ E25.14 EDGE$.AA2 EDGE$.BA2 EDGE$.CA2 ; also sheet 1,2
WD_ENAB: J1.Z ; also sheet 2
WPT: J1.BB ; also sheet 2
WRT_ECHO: J1.T ; also sheet 1
Unconnected: E25.1 E25.2 E25.3 E25.4 E25.5 E25.6 E25.8 E25.9 E25.10 E25.11 E25.12 E25.13 J1.R

### Notes on the sheet
- TD8E Simple DECtape Control
- E-CS-M868-0-1 | K

## Power pins joined to a net without a drawn wire
GND: E01.7(P:GND) E02.7(P:GND) E03.7(P:GND) E04.8(P:GND) E05.8(GND) E06.8(GND) E07.1(P:GND) E08.8(P:GND) E09.7(P:GND) E10.8(GND) E11.8(GND) E12.1(P:GND) E13.12(GND) E14.7(P:GND) E15.8(GND) E16.8(GND) E17.1(P:GND) E18.7(P:GND) E19.7(P:GND) E20.1(P:GND) E21.8(GND) E22.7(P:GND) E23.7(P:GND) E24.1(GND) E26.7(P:GND) E27.7(P:GND) E28.1(GND) E29.8(GND) E30.7(P:GND) E31.7(P:GND) E32.7(P:GND) E33.7(P:GND) E34.7(P:GND) E35.7(P:GND) E36.10(GND) E37.7(P:GND) E38.7(P:GND) E39.7(P:GND) E40.7(GND) E41.7(P:GND) E42.7(P:GND) E43.7(P:GND) E44.1(P:GND) E45.8(GND) E46.7(P:GND)
VCC: E01.14(P:VCC) E02.14(P:VCC) E03.14(P:VCC) E04.16(P:VCC) E05.16(VCC) E06.16(VCC) E07.8(P:VCC) E08.16(P:VCC) E09.14(P:VCC) E10.16(VCC) E11.16(VCC) E12.8(P:VCC) E13.5(VCC) E14.14(P:VCC) E15.16(VCC) E16.16(VCC) E17.8(P:VCC) E18.14(P:VCC) E19.14(P:VCC) E20.8(P:VCC) E21.16(VCC) E22.14(P:VCC) E23.14(P:VCC) E24.8(VCC) E26.14(P:VCC) E27.14(P:VCC) E28.8(VCC) E29.16(VCC) E30.14(P:VCC) E31.14(P:VCC) E32.14(P:VCC) E33.14(P:VCC) E34.14(P:VCC) E35.14(P:VCC) E36.5(VCC) E37.14(P:VCC) E38.14(P:VCC) E39.14(P:VCC) E40.14(VCC) E41.14(P:VCC) E42.14(P:VCC) E43.14(P:VCC) E44.8(P:VCC) E45.16(VCC) E46.14(P:VCC)

## Library data of the parts
C1-C33 C37-C45 C47 C48 = rcl:C-US: CAPACITOR, American symbol
C34-C36 C46 = dec-con:CPOL-USE20-8AXIAL: A 0.8 inch electrolytic.
D1-D10 = diode:1N4148: DIODE high speed (Philips)
E01 E26 E31 E32 = 74xx-us:74*04: Hex INVERTER
E02 E37 = 74xx-us:74*02: Quad 2-input NOR gate
E03 E09 E14 E30 E34 = 74xx-us:74*74: Dual D type positive edge triggered FLIP FLOP, preset and clear
E04 E08 = 74xx-us:74*123: Retriggerable monostable MULTIVIBRATOR
E05 E10 E15 = dec-con:DEC8235: 4-bit data selector
E06 E11 E16 E21 E29 = dec-con:DEC8271: Parallel Load Shift Register
E07 E12 E17 E20 E44 = dec-con:SP380: Quad NOR gate (use 8640)
E13 = 74xx-us:74*75: 4-bit bistable LATCH
E18 E42 = 74xx-us:74*266: Quadruple EXCLUSIVE-NOR (XNOR), open-collector
E19 E22 E38 = 74xx-us:74*00: Quad 2-input NAND gate
E23 E27 E35 = 74xx-us:74*10: Triple 3-input NAND gate
E24 = dec-con:SP314: 7-Input NOR gate
E25 = ic-package:DIL14: Dual In Line / Socket
E28 = dec-con:SP384: Quad OR gate
E33 E41 = dec-con:N8881: Quad 2-input NAND gate, open collector
E36 = 74xx-us:74*93: Decade, divide by twelve and binary COUNTER
E39 = 74xx-us:74*17: Hex INVERTER, open collector, high-voltage
E40 = 74xx-us:74*30: 8-input NAND gate
E43 E46 = 74xx-us:74*01: Quad 2-input NAND gate, open collector
E45 = dec-con:DEC8251: BCD Decoder
EDGE$ = dec-con:QUAD: Quad-Height DEC board
J1 = dec-con:DEC40PIN: PIN HEADER
Q1-Q5 = transistor-npn:2N2219: NPN Transistor
R1-R25 R27 R29-R43 R48 = rcl:R-US_: RESISTOR, American symbol
R26 = dec-con:275P: Trimpot with 275P (3006Y) footprint.
U$1 = dec-con:OUTLINE-*: Board outlines for DEC boards.
W2W1 W4W3 = jumper:0R2: Bridge switch 0R 2 x 10mm
WTM = switch-omron:31-XX: OMRON SWITCH; MPN: B3F-3100; OC_FARNELL: 959704; OC_NEWARK: 36M3582

## Net classes
1 supply: width 0.635 mm